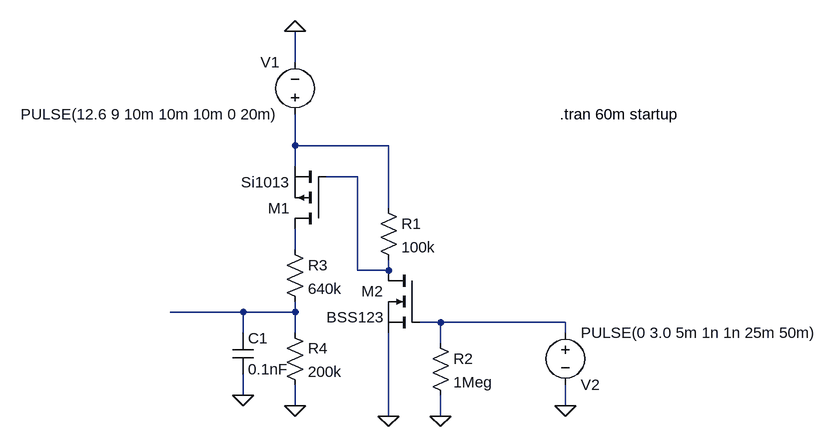
[diagram p0: schematic Draft1.asc]
Draft1.asc, the LTspice schematic file:
Version 4
SHEET 1 912 680
WIRE 48 -128 48 -176
WIRE 48 0 48 -48
WIRE 192 0 48 0
WIRE 48 32 48 0
WIRE 144 48 96 48
WIRE 192 96 192 0
WIRE 48 160 48 128
WIRE 144 192 144 48
WIRE 192 192 192 176
WIRE 192 192 144 192
WIRE -32 256 -144 256
WIRE 48 256 48 240
WIRE 48 256 -32 256
WIRE 272 272 240 272
WIRE 464 272 272 272
WIRE -32 288 -32 256
WIRE 48 288 48 256
WIRE 464 288 464 272
WIRE 272 304 272 272
WIRE -32 384 -32 352
WIRE 48 400 48 368
WIRE 464 400 464 368
WIRE 192 416 192 288
WIRE 272 416 272 384
FLAG 192 416 0
FLAG 48 400 0
FLAG 48 -176 0
FLAG 464 400 0
FLAG -32 384 0
FLAG 272 416 0
SYMBOL pmos 96 128 R180
SYMATTR InstName M1
SYMATTR Value Si1013
SYMBOL nmos 240 192 M0
SYMATTR InstName M2
SYMATTR Value BSS123
SYMBOL res 176 80 R0
SYMATTR InstName R1
SYMATTR Value 100k
SYMBOL res 32 144 R0
SYMATTR InstName R3
SYMATTR Value 640k
SYMBOL res 32 272 R0
SYMATTR InstName R4
SYMATTR Value 200k
SYMBOL voltage 48 -32 R180
WINDOW 0 24 96 Left 2
WINDOW 3 24 16 Left 2
WINDOW 123 0 0 Left 0
WINDOW 39 0 0 Left 0
SYMATTR InstName V1
SYMATTR Value PULSE(12.6 9 10m 10m 10m 0 20m)
SYMBOL voltage 464 272 R0
WINDOW 0 24 96 Left 2
WINDOW 3 24 16 Left 2
WINDOW 123 0 0 Left 0
WINDOW 39 0 0 Left 0
SYMATTR InstName V2
SYMATTR Value PULSE(0 3.0 5m 1n 1n 25m 50m)
SYMBOL cap -48 288 R0
SYMATTR InstName C1
SYMATTR Value 0.1nF
SYMBOL res 256 288 R0
SYMATTR InstName R2
SYMATTR Value 1Meg
TEXT 456 -48 Left 2 !.tran 60m startup

The netlist it stands for:
* Draft1.asc
M1 N003 N002 N001 N001 Si1013
M2 N002 N005 0 0 BSS123
R1 N001 N002 100k
R3 N003 N004 640k
R4 N004 0 200k
V1 N001 0 PULSE(12.6 9 10m 10m 10m 0 20m)
V2 N005 0 PULSE(0 3.0 5m 1n 1n 25m 50m)
C1 N004 0 0.1nF
R2 N005 0 1Meg
.model NMOS NMOS
.model PMOS PMOS
.lib standard.mos
.tran 60m startup
.backanno
.end